# Altium project ESP32-SIM800C.PrjPCB (part 1 of 2)
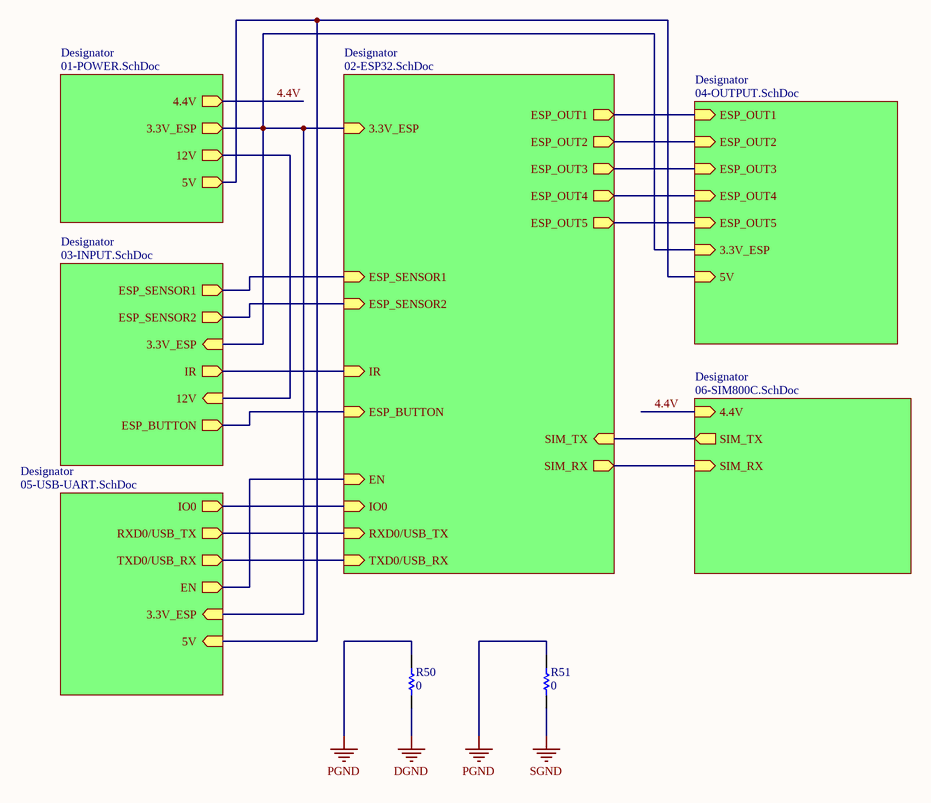
[diagram p0: Sheet1.SchDoc]
7 sheets, 149 parts. Net scope: flat (ports and power ports of the same name join across sheets).
Board file: ESP32-SIM800C_KIEN.PcbDoc
Sheets:
  Sheet1.SchDoc
    Designator = 03-INPUT.SchDoc
    Designator = 02-ESP32.SchDoc
    Designator = 01-POWER.SchDoc
    Designator = 04-OUTPUT.SchDoc
    Designator = 06-SIM800C.SchDoc
    Designator = 05-USB-UART.SchDoc

## Sheet Sheet1.SchDoc
size A; SheetNumber: 1; SheetTotal: 7

### Parts
R50  0  [RESC2012(0805)]
R51  0  [RESC2012(0805)]

### Sub-sheets
Designator = 03-INPUT.SchDoc: ESP_SENSOR1 (out), ESP_SENSOR2 (out), ESP_BUTTON (out), IR (out), 3.3V_ESP (in), 12V (in)
Designator = 02-ESP32.SchDoc: 3.3V_ESP (in), ESP_SENSOR1 (in), ESP_SENSOR2 (in), ESP_BUTTON (in), ESP_OUT1 (out), ESP_OUT2 (out), ESP_OUT3 (out), ESP_OUT4 (out), ESP_OUT5 (out), RXD0/USB_TX (in), TXD0/USB_RX (in), SIM_TX (in), SIM_RX (out), IR (in), IO0 (in), EN (in)
Designator = 01-POWER.SchDoc: 4.4V (out), 3.3V_ESP (out), 12V (out), 5V (out)
Designator = 04-OUTPUT.SchDoc: ESP_OUT1 (in), ESP_OUT2 (in), ESP_OUT3 (in), ESP_OUT4 (in), ESP_OUT5 (in), 3.3V_ESP (in), 5V (in)
Designator = 06-SIM800C.SchDoc: SIM_RX (in), SIM_TX (out), 4.4V (in)
Designator = 05-USB-UART.SchDoc: RXD0/USB_TX (out), TXD0/USB_RX (out), IO0 (out), EN (out), 3.3V_ESP (in), 5V (in)

### Nets
DGND: R50.2
PGND: R50.1 R51.1
SGND: R51.2
4.4V: sheet Designator/4.4V, sheet Designator/4.4V
(unnamed): sheet Designator/ESP_SENSOR1, sheet Designator/ESP_SENSOR1
(unnamed): sheet Designator/ESP_SENSOR2, sheet Designator/ESP_SENSOR2
(unnamed): sheet Designator/ESP_BUTTON, sheet Designator/ESP_BUTTON
(unnamed): sheet Designator/IR, sheet Designator/IR
(unnamed): sheet Designator/3.3V_ESP, sheet Designator/3.3V_ESP, sheet Designator/3.3V_ESP, sheet Designator/3.3V_ESP, sheet Designator/3.3V_ESP
(unnamed): sheet Designator/12V, sheet Designator/12V
(unnamed): sheet Designator/ESP_OUT1, sheet Designator/ESP_OUT1
(unnamed): sheet Designator/ESP_OUT2, sheet Designator/ESP_OUT2
(unnamed): sheet Designator/ESP_OUT3, sheet Designator/ESP_OUT3
(unnamed): sheet Designator/ESP_OUT4, sheet Designator/ESP_OUT4
(unnamed): sheet Designator/ESP_OUT5, sheet Designator/ESP_OUT5
(unnamed): sheet Designator/RXD0/USB_TX, sheet Designator/RXD0/USB_TX
(unnamed): sheet Designator/TXD0/USB_RX, sheet Designator/TXD0/USB_RX
(unnamed): sheet Designator/SIM_TX, sheet Designator/SIM_TX
(unnamed): sheet Designator/SIM_RX, sheet Designator/SIM_RX
(unnamed): sheet Designator/IO0, sheet Designator/IO0
(unnamed): sheet Designator/EN, sheet Designator/EN
(unnamed): sheet Designator/5V, sheet Designator/5V, sheet Designator/5V

### Library data of the parts
R50 R51 = 34.8K/R0805/1%: 0 Ohms ±1% 0.125W, 1/8W Chip Resistor 0805 (2012 Metric) Automotive AEC-Q200 Thick Film; Power Rating: 100mW; Voltage Rating: 50V; Case/Package: 0603; Case Code (Imperial): 0603; Case Code (Metric): 1608; Min Operating Temperature: -55°C; Max Operating Temperature: 155°C; Resistance: 0; Termination: SMD/SMT; Military Standard: Not; Voltage Rating (DC): 50V; Length: 1.6mm; Height: 0.45mm; Width: 0.8mm; Depth: 0.8mm; Lead Free: Lead Free; Digikey: 541-1.00KCCT-ND

## Sheet 03-INPUT.SchDoc: *INPUT
size A4; SheetNumber: 4; SheetTotal: 7
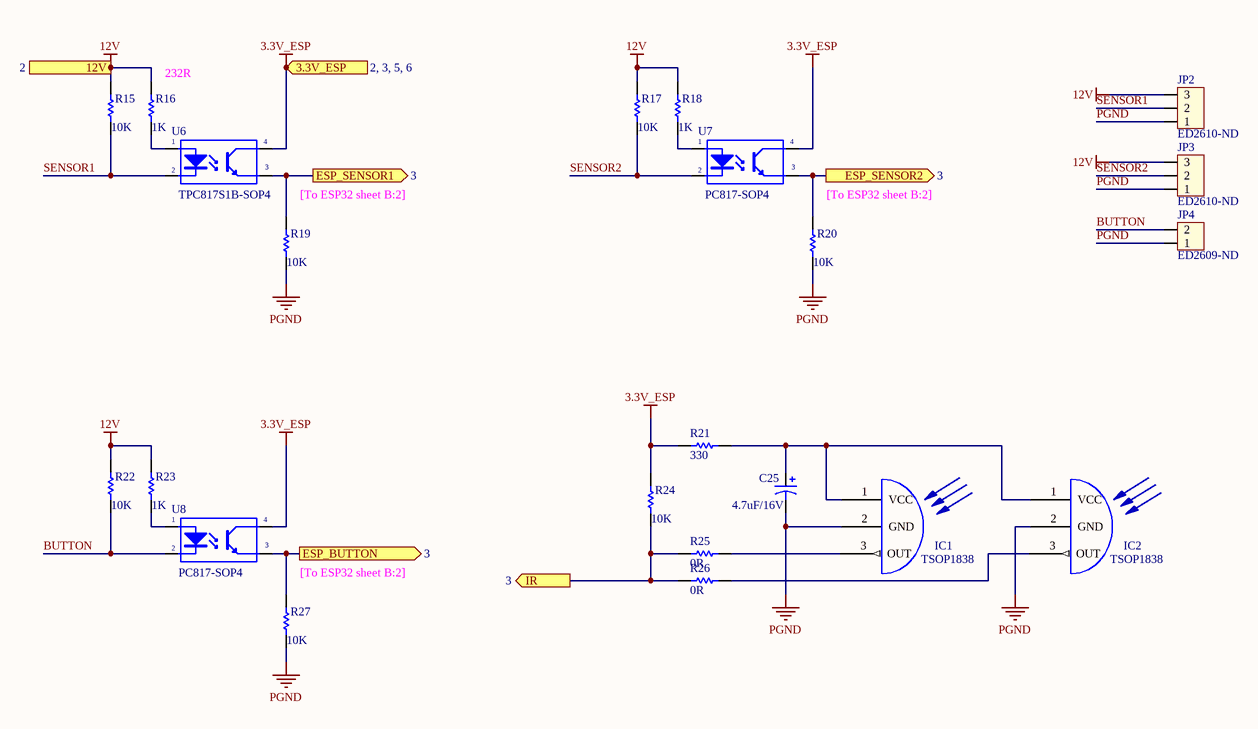
[diagram p1: 03-INPUT.SchDoc]

### Parts
C25  value 4.7uF/16V  [C0805]  (hidden comment: Cap Pol1)
IC1  TSOP1838  [TSOP1838]
IC2  TSOP1838  [TSOP1838]
JP2  ED2610-ND  [DOMINO_OSTTC_3P]
JP3  ED2610-ND  [DOMINO_OSTTC_3P]
JP4  ED2609-ND  [DOMINO_OSTTC_2P]
R15  10K  [Res 0805 SMD]
R16  1K  [Res 0805 SMD]
R17  10K  [Res 0805 SMD]
R18  1K  [Res 0805 SMD]
R19  10K  [Res 0805 SMD]
R20  10K  [Res 0805 SMD]
R21  330  [Res 0805 SMD]
R22  10K  [Res 0805 SMD]
R23  1K  [Res 0805 SMD]
R24  10K  [Res 0805 SMD]
R25  0R  [Res 0805 SMD]
R26  0R  [Res 0805 SMD]
R27  10K  [Res 0805 SMD]
U6  TPC817S1B-SOP4  [TPC817-4SOP]
U7  PC817-SOP4  [TPC817-4SOP]
U8  PC817-SOP4  [TPC817-4SOP]

### Ports
3.3V_ESP (in, see 2, 3, 5, 6), 12V (in, see 2), ESP_BUTTON (out, see 3), ESP_SENSOR1 (out, see 3), ESP_SENSOR2 (out, see 3), IR (out, see 3)

### Nets
3.3V_ESP: R21.2 R24.2 U6.4(C) U7.4(C) U8.4(C) ; port 3.3V_ESP
12V: JP2.3 JP3.3 R15.2 R16.2 R17.2 R18.2 R22.2 R23.2 ; port 12V
PGND: C25.2 IC1.2(GND) IC2.2(GND) JP2.1 JP3.1 JP4.1 R19.1 R20.1 R27.1
BUTTON: JP4.2 R22.1 U8.2(K)
SENSOR1: JP2.2 R15.1 U6.2(K)
SENSOR2: JP3.2 R17.1 U7.2(K)
NetC25_1: C25.1 IC1.1(VCC) IC2.1(VCC) R21.1
NetIC1_3: IC1.3(OUT) R25.1
NetIC2_3: IC2.3(OUT) R26.1
NetR16_1: R16.1 U6.1(A)
NetR18_1: R18.1 U7.1(A)
NetR19_2: R19.2 U6.3(E) ; port ESP_SENSOR1
NetR20_2: R20.2 U7.3(E) ; port ESP_SENSOR2
NetR23_1: R23.1 U8.1(A)
NetR24_1: R24.1 R25.2 R26.2 ; port IR
NetR27_2: R27.2 U8.3(E) ; port ESP_BUTTON

### Notes on the sheet
- (near R16) 232R
- [To ESP32 sheet B:2]
- Title
- Size:
- Date:
- A4
- Number:
- Time:
- Revision:
- Sheet
- of
- File:

### Library data of the parts
C25 = Cap Pol1: Polarized Capacitor (Radial); Published: 8-Jun-2000; LatestRevisionDate: 17-Jul-2002; LatestRevisionNote: Re-released for DXP Platform.; PackageReference: RB7.6-15; Publisher: Altium Limited; PackageDescription: Polarized Capacitor (Radial); 2 Leads
JP2 JP3 = Con3: 3 Position Wire to Board Terminal Block Horizontal with Board 0.200" (5.08mm) Through Hole; Value: Connector 3; Digikey: ED2610-ND
JP4 = Con2: 2 Position Wire to Board Terminal Block Horizontal with Board 0.200" (5.08mm) Through Hole; Value: Connector 2; Digikey: ED2609-ND
R15 R17 R22 = 10K/R0603/1%: RES SMD 10K OHM 1% 1/10W 0603; Manufacturer: Yageo; Manufacturer Part Number: RC0603FR-0710KL; Power (Watts): 0.1W, 1/10W; Temperature Coefficient: ±100ppm/°C; Supplier 1: Digi-Key; RoHS: RoHS Compliant; Category: Resistors; Stock 1: 11440000; Pricing 1: 5000=0.00167, 10000=0.00145, 25000=0.00128, 50000=0.00117, 125000=0.00115 (USD); Packaging: Tape & Reel (TR); Resistance (Ohms): 10k; Tolerance: ±1%; Composition: Thick Film; Features: Moisture Resistant; Operating Temperature: -55°C ~ 155°C; Package / Case: 0603 (1608 Metric); Supplier Device Package: 0603; Size / Dimension: 0.063" L x 0.031" W (1.60mm x 0.80mm); Height: 0.022" (0.55mm); Number of Terminations: 2; ComponentLink1URL: http://www.yageo.com/NewPortal/yageodocoutput?fileName=/pdf/R-Chip/PYu-RC_Group_51_RoHS_L_3.pdf; ComponentLink1Description: http://www.yageo.com/NewPortal/yageodocoutput?fileName=/pdf/R-Chip/PYu-RC_Group_51_RoHS_L_3.pdf; Supplier Part Number 1: 311-10.0KHRTR-ND
R16 R18 R23 = 10K/R0603/1%: 1 kOhms ±1% 0.125W, 1/8W Chip Resistor 0805 (2012 Metric) Automotive AEC-Q200 Thick Film; Resistance (Ohms): 10k; Power (Watts): 0.1W, 1/10W; RoHS: RoHS Compliant; Category: Resistors; Features: Moisture Resistant; Operating Temperature: -55°C ~ 155°C; Package / Case: 0603 (1608 Metric); Supplier Device Package: 0603; Size / Dimension: 0.063" L x 0.031" W (1.60mm x 0.80mm); Height: 0.022" (0.55mm); Number of Terminations: 2; ComponentLink1URL: http://www.yageo.com/NewPortal/yageodocoutput?fileName=/pdf/R-Chip/PYu-RC_Group_51_RoHS_L_3.pdf; ComponentLink1Description: http://www.yageo.com/NewPortal/yageodocoutput?fileName=/pdf/R-Chip/PYu-RC_Group_51_RoHS_L_3.pdf; Digikey: 541-1.00KCCT-ND
R19-R21 R24-R27 = 249K/R0805/1%: RES SMD 249K OHM 1% 1/10W 0805; Manufacturer: Yageo; Manufacturer Part Number: RC0603FR-07249KL; Power (Watts): 0.1W, 1/10W; Temperature Coefficient: ±100ppm/°C; Supplier 1: Digi-Key; RoHS: RoHS Compliant; Category: Resistors; Stock 1: 370515; Pricing 1: 1=0.1, 10=0.015, 100=0.006, 1000=0.00268, 2500=0.00233 (USD); Packaging: Cut Tape (CT); Part Status: Active; Tolerance: ±1%; Composition: Thick Film; Features: Moisture Resistant; Operating Temperature: -55°C ~ 155°C; Package / Case: 0603 (1608 Metric); Supplier Device Package: 0603; Size / Dimension: 0.063" L x 0.032" W (1.60mm x 0.80mm); Height - Seated (Max): 0.022" (0.55mm); Failure Rate: -; ComponentLink1URL: http://www.yageo.com/documents/recent/PYu-RC_Group_51_RoHS_L_8.pdf; ComponentLink1Description: http://www.yageo.com/documents/recent/PYu-RC_Group_51_RoHS_L_8.pdf
U6-U8 = PC817: Optoisolator Transistor Output 5000Vrms 1 Channel 4-SOP; Digikey: TPC817S1BRAGCT-ND
  U7 U8: BuyVN: https://banlinhkien.vn/goods-1134-pc817-el817-sop4-opto.html

## Sheet 02-ESP32.SchDoc: *ESP32LX6
size A4; SheetNumber: 3; SheetTotal: 7
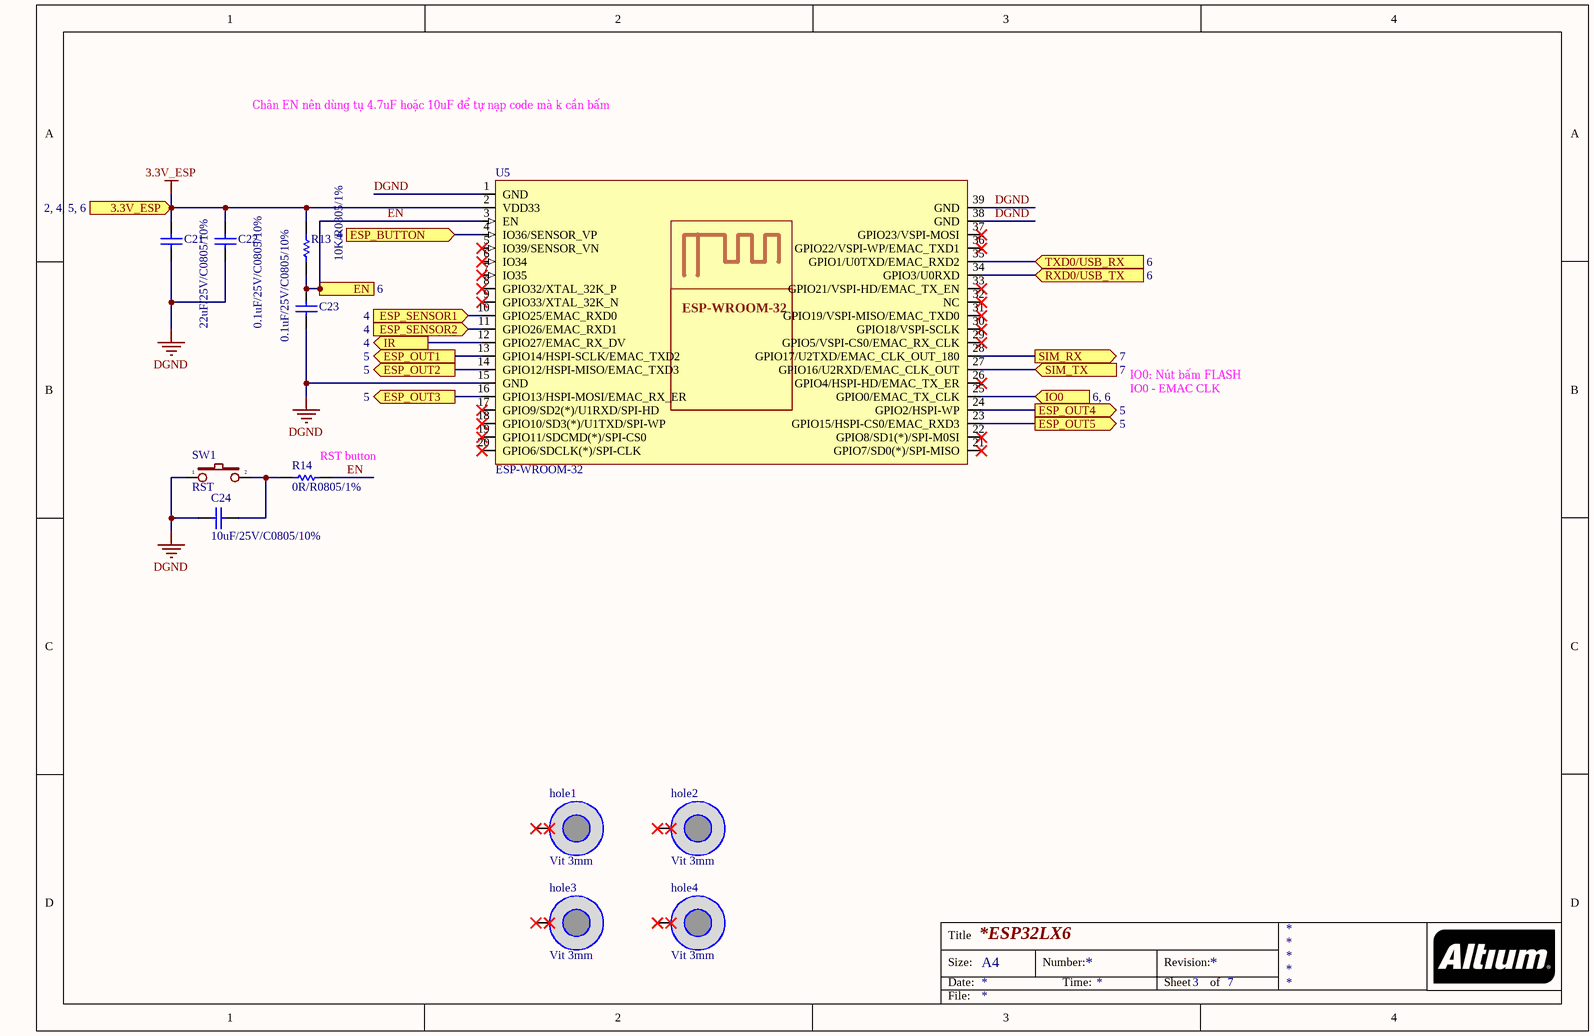
[diagram p2: 02-ESP32.SchDoc]

### Parts
C21  22uF/25V/C0805/10%  [CAP_CERA_C2012(CC0805INCH)]
C22  0.1uF/25V/C0805/10%  [CAP_CERA_C2012(CC0805INCH)]
C23  0.1uF/25V/C0805/10%  [CAP_CERA_C2012(CC0805INCH)]
C24  10uF/25V/C0805/10%  [CAP_CERA_C2012(CC0805INCH)]
hole1  Vit 3mm  [Screw 3.0]
hole2  Vit 3mm  [Screw 3.0]
hole3  Vit 3mm  [Screw 3.0]
hole4  Vit 3mm  [Screw 3.0]
R13  10K/R0805/1%  [Res 0805 SMD]
R14  0R/R0805/1%  [Res 0805 SMD]
SW1  RST  [Button 3x4mm]
U5  ESP-WROOM-32  [ESP32 WROOM]

### Ports
3.3V_ESP (in, see 2, 4, 5, 6), EN (in, see 6), ESP_BUTTON (in, see 4), ESP_OUT1 (out, see 5), ESP_OUT2 (out, see 5), ESP_OUT3 (out, see 5), ESP_OUT4 (out, see 5), ESP_OUT5 (out, see 5), ESP_SENSOR1 (in, see 4), ESP_SENSOR2 (in, see 4), IO0 (in, see 6, 6), IR (out, see 4), RXD0/USB_TX (in, see 6), SIM_RX (out, see 7), SIM_TX (in, see 7), TXD0/USB_RX (in, see 6)

### Nets
3.3V_ESP: C21.2 C22.2 R13.1 U5.2(VDD33) ; port 3.3V_ESP
DGND: C21.1 C22.1 C23.1 C24.2 SW1.1 U5.1(GND) U5.15(GND) U5.38(GND) U5.39(GND)
EN: C23.2 R13.2 R14.2 U5.3(EN) ; port EN
IO0: U5.25(GPIO0/EMAC_TX_CLK) ; port IO0
SIM_RX: U5.28(GPIO17/U2TXD/EMAC_CLK_OUT_180) ; port SIM_RX
SIM_TX: U5.27(GPIO16/U2RXD/EMAC_CLK_OUT) ; port SIM_TX
NetC24_1: C24.1 R14.1 SW1.2
NetR19_2: U5.10(GPIO25/EMAC_RXD0) ; port ESP_SENSOR1
NetR20_2: U5.11(GPIO26/EMAC_RXD1) ; port ESP_SENSOR2
NetR24_1: U5.12(GPIO27/EMAC_RX_DV) ; port IR
NetR27_2: U5.4(IO36/SENSOR_VP) ; port ESP_BUTTON
NetR35_1: U5.34(GPIO3/U0RXD) ; port RXD0/USB_TX
NetR36_1: U5.35(GPIO1/U0TXD/EMAC_RXD2) ; port TXD0/USB_RX
NetU5_13: U5.13(GPIO14/HSPI-SCLK/EMAC_TXD2) ; port ESP_OUT1
NetU5_14: U5.14(GPIO12/HSPI-MISO/EMAC_TXD3) ; port ESP_OUT2
NetU5_16: U5.16(GPIO13/HSPI-MOSI/EMAC_RX_ER) ; port ESP_OUT3
NetU5_23: U5.23(GPIO15/HSPI-CS0/EMAC_RXD3) ; port ESP_OUT5
NetU5_24: U5.24(GPIO2/HSPI-WP) ; port ESP_OUT4

Not connected (* = marked no-connect by the designer): hole1 1(hole)*; hole2 1(hole)*; hole3 1(hole)*; hole4 1(hole)*; U5 5(IO39/SENSOR_VN)* 6(IO34)* 7(IO35)* 8(GPIO32/XTAL_32K_P)* 9(GPIO33/XTAL_32K_N)* 17(GPIO9/SD2(*)/U1RXD/SPI-HD)* 18(GPIO10/SD3(*)/U1TXD/SPI-WP)* 19(GPIO11/SDCMD(*)/SPI-CS0)* 20(GPIO6/SDCLK(*)/SPI-CLK)* 21(GPIO7/SD0(*)/SPI-MISO)* 22(GPIO8/SD1(*)/SPI-M0SI)* 26(GPIO4/HSPI-HD/EMAC_TX_ER)* 29(GPIO5/VSPI-CS0/EMAC_RX_CLK)* 30(GPIO18/VSPI-SCLK)* 31(GPIO19/VSPI-MISO/EMAC_TXD0)* 32(NC)* 33(GPIO21/VSPI-HD/EMAC_TX_EN)* 36(GPIO22/VSPI-WP/EMAC_TXD1)* 37(GPIO23/VSPI-MOSI)*

### Notes on the sheet
- Chân EN nên dùng tụ 4.7uF hoặc 10uF để tự nạp code mà k cần bấm
- IO0: Nút bấm FLASH
- IO0 - EMAC CLK
- (near R14) RST button
- Title
- Size:
- Date:
- A4
- Number:
- Time:
- Revision:
- Sheet
- of
- File:

### Library data of the parts
C21 = 0.1uF/50V/C0603/10%: 22µF ±20% 25V Ceramic Capacitor X5R 0805 (2012 Metric); Manufacturer: Tariff Applied; ComponentLink1URL: http://www.murata.com/~/media/webrenewal/support/library/catalog/products/capacitor/mlcc/c02e.ashx; ComponentLink1Description: http://www.murata.com/~/media/webrenewal/support/library/catalog/products/capacitor/mlcc/c02e.ashx; Digikey: 1276-2908-1-ND
C22-C24 = 0.1uF/50V/C0603/10%: 0.1µF ±10% 25V Ceramic Capacitor X7R 0805 (2012 Metric); ComponentLink1URL: http://www.murata.com/~/media/webrenewal/support/library/catalog/products/capacitor/mlcc/c02e.ashx; ComponentLink1Description: http://www.murata.com/~/media/webrenewal/support/library/catalog/products/capacitor/mlcc/c02e.ashx; Digikey: 478-3755-1-ND
R13 = 200K/R0603/1%: 10 kOhms ±1% 0.125W, 1/8W Chip Resistor 0805 (2012 Metric) Thick Film; Power (Watts): 0.1W, 1/10W; RoHS: RoHS Compliant; Category: Resistors; Part Status: Active; Features: Moisture Resistant; Operating Temperature: -55°C ~ 155°C; Package / Case: 0603 (1608 Metric); Supplier Device Package: 0603; Size / Dimension: 0.063" L x 0.031" W (1.60mm x 0.80mm); Height - Seated (Max): 0.022" (0.55mm); Failure Rate: -; ComponentLink1URL: http://www.yageo.com/documents/recent/PYu-RC_Group_51_RoHS_L_7.pdf; ComponentLink1Description: http://www.yageo.com/documents/recent/PYu-RC_Group_51_RoHS_L_7.pdf; Digikey: A126332CT-ND
R14 = 200K/R0603/1%: 0 Ohms Jumper 0.125W, 1/8W Chip Resistor 0805 (2012 Metric) Automotive AEC-Q200 Thick Film; Part Status: Active; Height - Seated (Max): 0.022" (0.55mm); Failure Rate: -; ComponentLink1URL: http://www.yageo.com/documents/recent/PYu-RC_Group_51_RoHS_L_7.pdf; ComponentLink1Description: http://www.yageo.com/documents/recent/PYu-RC_Group_51_RoHS_L_7.pdf; Digikey: 541-0.0ACT-ND
SW1 = SW2: SWITCH TACTILE SPST-NO 0.05A 12V; Digikey: CKN10384CT-ND
U5 = ESP-WROOM-32: ESP-WROOM-32 (8MB), WIFI MODULE 64 MBITS SPI FLASH; Digikey: 1904-1019-1-ND

## Sheet 01-POWER.SchDoc: *NGUON4V4
size A3; SheetNumber: 2; SheetTotal: 7
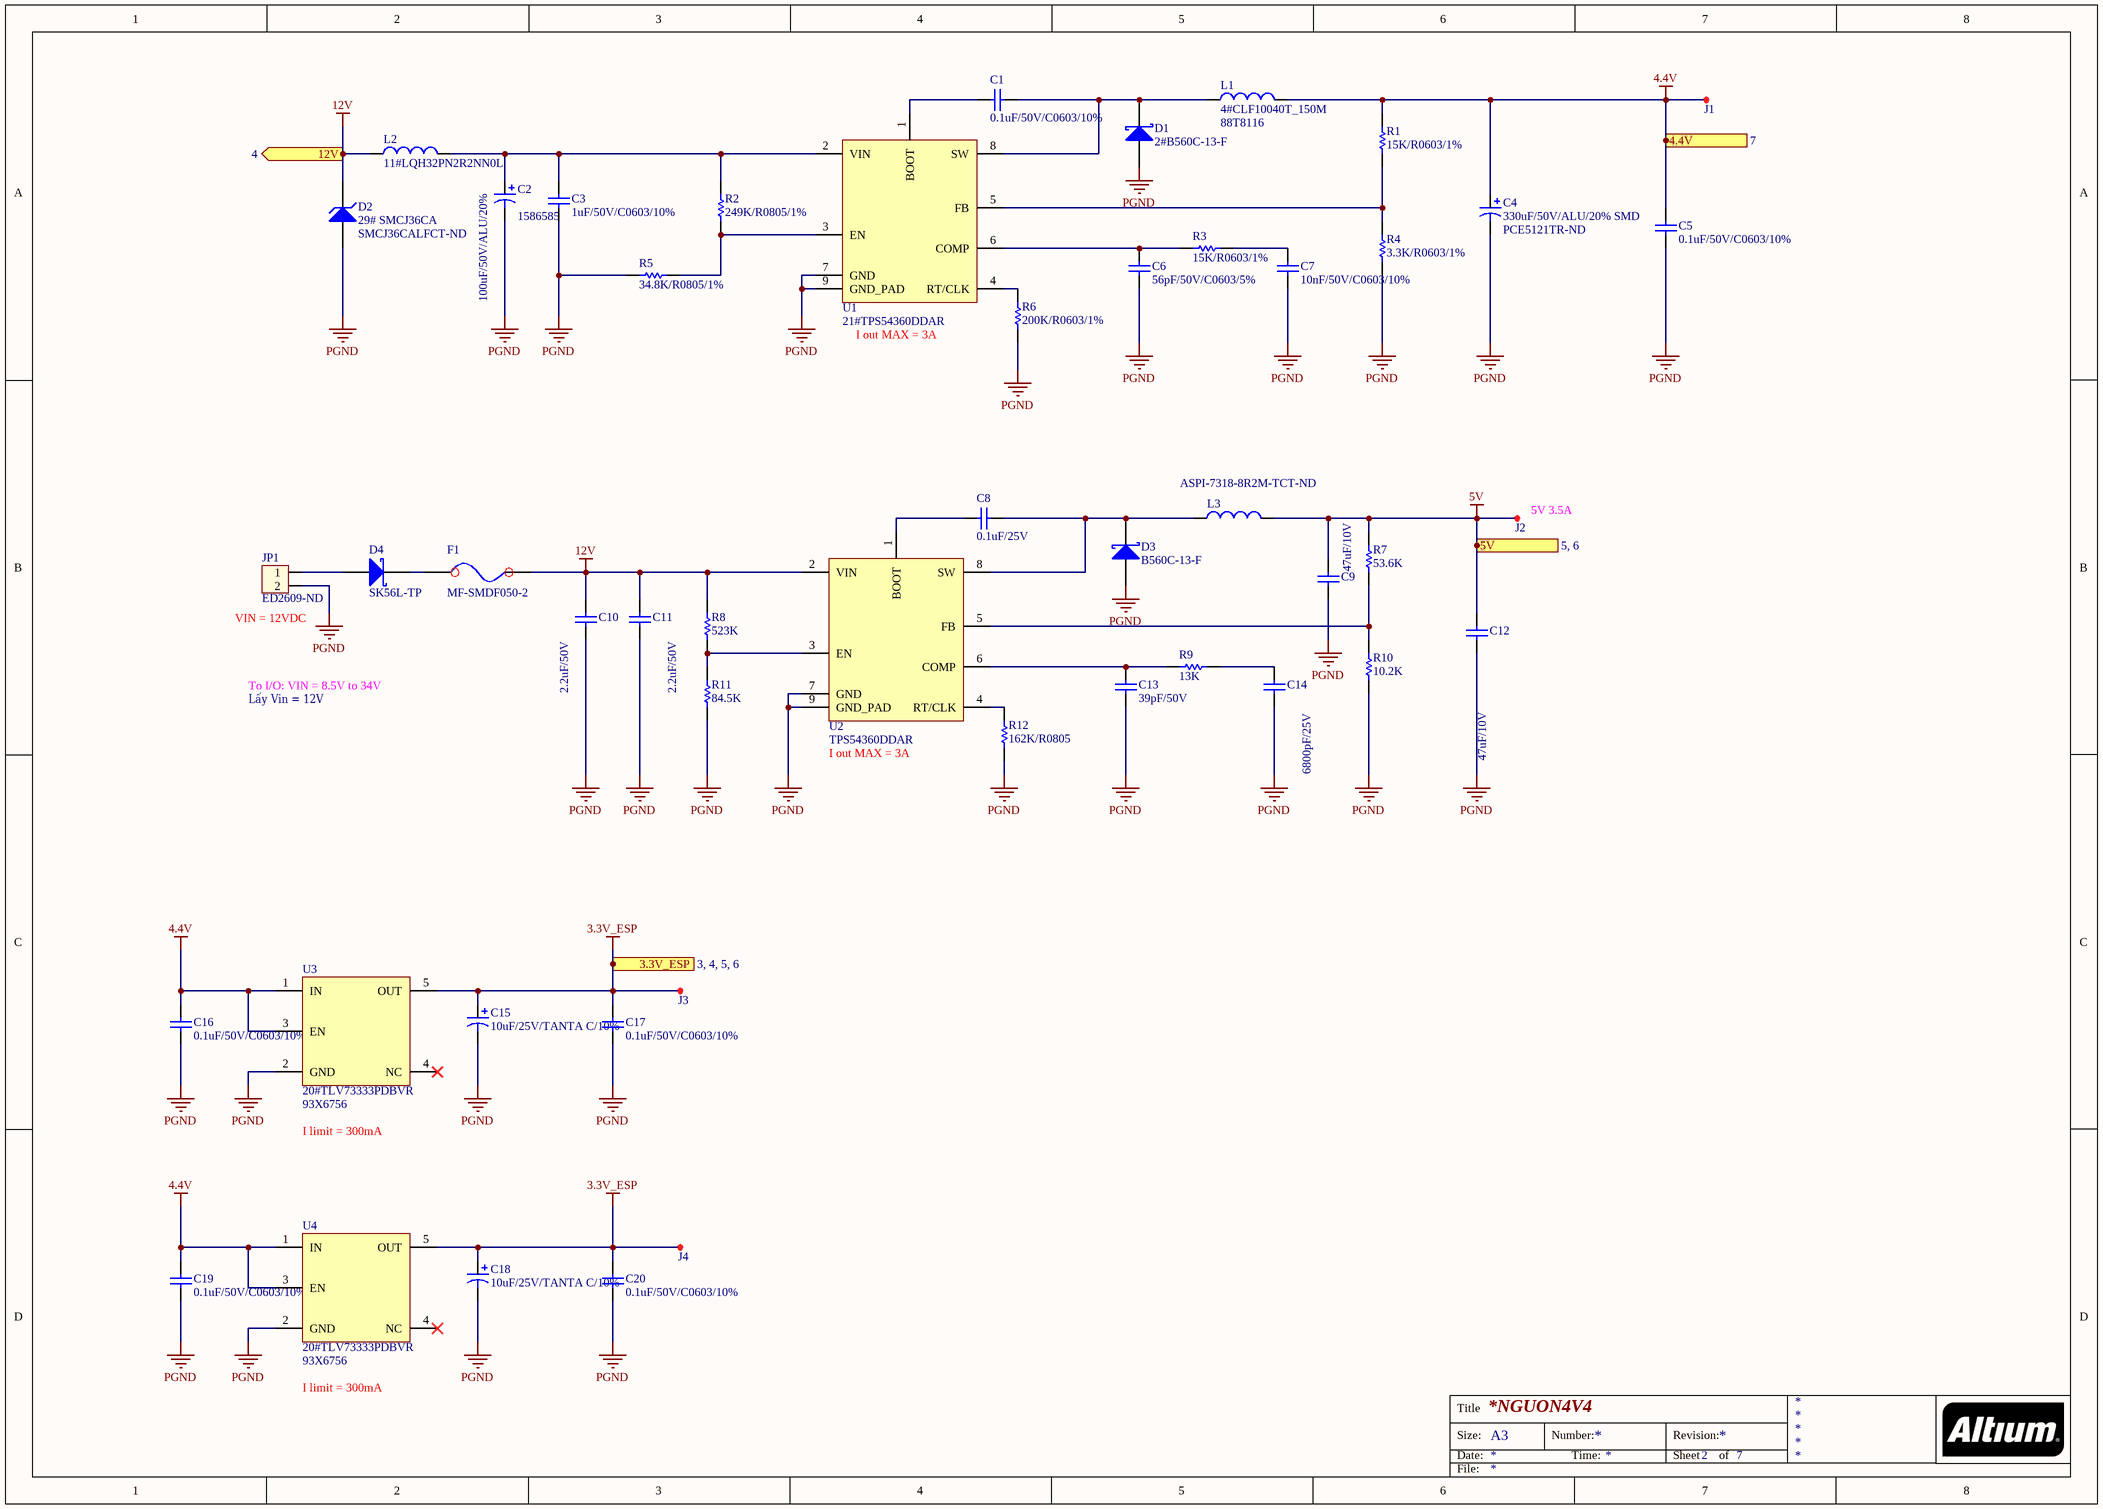
[diagram p3: 01-POWER.SchDoc]

### Parts
C1  0.1uF/50V/C0603/10%  [Cap Ceramic 0603 SMD]
C2  100uF/50V/ALU/20%  Supplier Part Number 1: 1586585  [CAP ALU CASE F SMD]
C3  1uF/50V/C0603/10%  [Cap Ceramic 0603 SMD]
C4  330uF/50V/ALU/20% SMD  Supplier Part Number 1: PCE5121TR-ND  [CAP ALU CASE G SMD]
C5  0.1uF/50V/C0603/10%  [Cap Ceramic 0603 SMD]
C6  56pF/50V/C0603/5%  [Cap Ceramic 0603 SMD]
C7  10nF/50V/C0603/10%  [Cap Ceramic 0603 SMD]
C8  0.1uF/25V  [CAP_CERA_C2012(CC0805INCH)]
C9  47uF/10V  [CAP_CERA_C2012(CC0805INCH)]
C10  2.2uF/50V  [CAP_CERA_C2012(CC0805INCH)]
C11  2.2uF/50V  [CAP_CERA_C2012(CC0805INCH)]
C12  47uF/10V  [CAP_CERA_C2012(CC0805INCH)]
C13  39pF/50V  [CAP_CERA_C2012(CC0805INCH)]
C14  6800pF/25V  [CAP_CERA_C2012(CC0805INCH)]
C15  10uF/25V/TANTA C/10%  [CAP TANT CASE C SMD]
C16  0.1uF/50V/C0603/10%  [Cap Ceramic 0603 SMD]
C17  0.1uF/50V/C0603/10%  [Cap Ceramic 0603 SMD]
C18  10uF/25V/TANTA C/10%  [CAP TANT CASE C SMD]
C19  0.1uF/50V/C0603/10%  [Cap Ceramic 0603 SMD]
C20  0.1uF/50V/C0603/10%  [Cap Ceramic 0603 SMD]
D1  2#B560C-13-F  [2# B560C]
D2  29# SMCJ36CA  Supplier Part Number 1: SMCJ36CALFCT-ND  [29# diode SMCJ36A]
D3  B560C-13-F  [2# B560C]
D4  SK56L-TP  [30# SK56L-TPMSCT-ND]
F1  MF-SMDF050-2  [13# MF-SMDF050]
J1  TEST POINT  [TEST POINT 1mm]  (value not drawn)
J2  TEST POINT  [TEST POINT 1mm]  (value not drawn)
J3  TEST POINT  [TEST POINT 1mm]  (value not drawn)
J4  TEST POINT  [TEST POINT 1mm]  (value not drawn)
JP1  ED2609-ND  [DOMINO_OSTTC_2P]
L1  4#CLF10040T_150M  Supplier Part Number 1: 88T8116  [4# clf10040XX]
L2  11#LQH32PN2R2NN0L  [11# LQH32PN2R2]
L3  ASPI-7318-8R2M-TCT-ND  [ASPI-7318-8R2M-TCT-ND]
R1  15K/R0603/1%  [Res 0603 SMD]
R2  249K/R0805/1%  [Res 0805 SMD]
R3  15K/R0603/1%  [Res 0603 SMD]
R4  3.3K/R0603/1%  [Cap Ceramic 0603 SMD]
R5  34.8K/R0805/1%  [Res 0805 SMD]
R6  200K/R0603/1%  [Res 0603 SMD]
R7  53.6K  [Res 0805 SMD]
R8  523K  [Res 0805 SMD]
R9  13K  [Res 0805 SMD]
R10  10.2K  [Res 0805 SMD]
R11  84.5K  [Res 0805 SMD]
R12  162K/R0805  [Res 0805 SMD]
U1  21#TPS54360DDAR  [21# TPS54360]
U2  TPS54360DDAR  [21# TPS54360]
U3  20#TLV73333PDBVR  Supplier Part Number 1: 93X6756  [TLV73333PDBVR - SOT23-65]
U4  20#TLV73333PDBVR  Supplier Part Number 1: 93X6756  [TLV73333PDBVR - SOT23-65]

### Ports
3.3V_ESP (out, see 3, 4, 5, 6), 4.4V (out, see 7), 5V (out, see 5, 6), 12V (out, see 4)

### Nets
3.3V_ESP: C15.1 C17.2 C18.1 C20.2 J3.1(TP) J4.1(TP) U3.5(OUT) U4.5(OUT) ; port 3.3V_ESP
4.4V: C4.1 C5.2 C16.2 C19.2 J1.1(TP) L1.2 R1.2 U3.1(IN) U3.3(EN) U4.1(IN) U4.3(EN) ; port 4.4V
5V: C9.2 C12.2 J2.1(TP) L3.2 R7.2 ; port 5V
12V: C10.2 C11.2 D2.2(K) F1.2(OUT) L2.1 R8.2 U2.2(VIN) ; port 12V
PGND: C2.2 C3.1 C4.2 C5.1 C6.1 C7.1 C9.1 C10.1 C11.1 C12.1 C13.1 C14.1 C15.2 C16.1 C17.1 C18.2 C19.1 C20.1 D1.1(A) D2.1(A) D3.1(A) JP1.2 R4.1 R5.1 R6.2 R10.1 R11.1 R12.2 U1.7(GND) U1.9(GND_PAD) U2.7(GND) U2.9(GND_PAD) U3.2(GND) U4.2(GND)
NetC1_1: C1.1 U1.1(BOOT)
NetC1_2: C1.2 D1.2(K) L1.1 U1.8(SW)
NetC2_1: C2.1 C3.2 L2.2 R2.2 U1.2(VIN)
NetC6_2: C6.2 R3.2 U1.6(COMP)
NetC7_2: C7.2 R3.1
NetC8_1: C8.1 D3.2(K) L3.1 U2.8(SW)
NetC8_2: C8.2 U2.1(BOOT)
NetC13_2: C13.2 R9.2 U2.6(COMP)
NetC14_2: C14.2 R9.1
NetD4_1: D4.1(A) JP1.1
NetD4_2: D4.2(K) F1.1(IN)
NetR1_1: R1.1 R4.2 U1.5(FB)
NetR2_1: R2.1 R5.2 U1.3(EN)
NetR6_1: R6.1 U1.4(RT/CLK)
NetR7_1: R7.1 R10.2 U2.5(FB)
NetR8_1: R8.1 R11.2 U2.3(EN)
NetR12_1: R12.1 U2.4(RT/CLK)

Not connected (* = marked no-connect by the designer): U3 4(NC)*; U4 4(NC)*

### Notes on the sheet
- (near U1) I out MAX = 3A
- (near J2) 5V 3.5A
- (near JP1) VIN = 12VDC
- To I/O: VIN = 8.5V to 34V
- Lấy Vin = 12V
- (near U2) I out MAX = 3A
- I limit = 300mA
- Title
- Size:
- Date:
- A3
- Number:
- Time:
- Revision:
- Sheet
- of
- File:

### Library data of the parts
C1 C5 C16 C17 C19 C20 = 0.1uF/50V/C0603/10%: CAP CER 0.1UF 50V 10% X7R 0603; Manufacturer: Murata Electronics North America; Manufacturer Part Number: GRM188R71H104KA93D; Capacitance: 0.1µF; RoHS: RoHS Compliant; Category: Capacitors; Packaging: Tape & Reel (TR); Tolerance: ±10%; Voltage - Rated: 50V; Temperature Coefficient: X7R; Mounting Type: Surface Mount, MLCC; Operating Temperature: -55°C ~ 125°C; Applications: General Purpose; Ratings: -; Package / Case: 0603 (1608 Metric); Size / Dimension: 0.063" L x 0.031" W (1.60mm x 0.80mm); Height - Seated (Max): -; Thickness (Max): 0.035" (0.90mm); Lead Spacing: -; Features: -; Lead Style: -; ComponentLink1URL: http://www.murata.com/~/media/webrenewal/support/library/catalog/products/capacitor/mlcc/c02e.ashx; ComponentLink1Description: http://www.murata.com/~/media/webrenewal/support/library/catalog/products/capacitor/mlcc/c02e.ashx; Supplier 1: Digi-Key; Supplier Part Number 1: 490-1519-1-ND
C2 = 100uF/50V/ALU 8X11.5/20%: CAP ALU 100UF 20% 50V RADIAL; Manufacturer: Panasonic Electronic Components; Manufacturer Part Number: ECA-1HM101B; Capacitance: 100µF; Lifetime @ Temp.: 2000 Hrs @ 85°C; Ripple Current: 250mA; RoHS: RoHS Compliant; Category: Capacitors; Packaging: Tape & Box (TB); Tolerance: ±20%; Voltage Rating: 50V; ESR (Equivalent Series Resistance): -; Operating Temperature: -40°C ~ 85°C; Type: -; Applications: General Purpose; Impedance: -; Lead Spacing: 0.197" (5.00mm); Size / Dimension: 0.315" Dia (8.00mm); Height - Seated (Max): 0.492" (12.50mm); Surface Mount Land Size: -; Mounting Type: Through Hole; Package / Case: Radial, Can; ComponentLink1URL: http://industrial.panasonic.com/www-cgi/jvcr13pz.cgi?E+PZ+3+ABA0012+ECA1HM101B+7+WW; ComponentLink1Description: http://industrial.panasonic.com/www-cgi/jvcr13pz.cgi?E+PZ+3+ABA0012+ECA1HM101B+7+WW; Supplier 1: Future Electronics
C3 = 1uF/50V/C0603/10%: CAP CER 1UF 50V X7R 0603; Manufacturer: Samsung Electro-Mechanics America, Inc.; Manufacturer Part Number: CL21B105KBFNNNE; Capacitance: 1µF; Tolerance: ±10%; RoHS: RoHS Compliant; Category: Capacitors; Packaging: Cut Tape (CT); Voltage - Rated: 50V; Temperature Coefficient: X7R; Mounting Type: Surface Mount, MLCC; Operating Temperature: -55°C ~ 125°C; Applications: General Purpose; Ratings: -; Package / Case: 0805 (2012 Metric); Size / Dimension: 0.079" L x 0.049" W (2.00mm x 1.25mm); Height - Seated (Max): -; Thickness (Max): 0.053" (1.35mm); Lead Spacing: -; Features: -; Lead Style: -; ComponentLink1URL: http://www.samsungsem.com/kr/support/product-search/mlcc/CL21B105KBFNNNE.jsp; ComponentLink1Description: http://www.samsungsem.com/kr/support/product-search/mlcc/CL21B105KBFNNNE.jsp; Supplier 1: Digi-Key; Supplier Part Number 1: 1276-1029-1-ND
C4 = 330uF/50V/ALU12.5X20mm/20%/7000Hrs: CAP ALU 330UF 20% 50V SMD; Manufacturer: Nichicon; Manufacturer Part Number: UPW1J331MHD; Lifetime @ Temp.: 7000 Hrs @ 105°C; Polarization: Polar; Ripple Current - Low Frequency: 838.5mA @ 120Hz; Ripple Current - High Frequency: 1.29A @ 100kHz; RoHS: RoHS Compliant; Category: Capacitors; Packaging: Bulk; Part Status: Active; Tolerance: ±20%; ESR (Equivalent Series Resistance): -; Operating Temperature: -55°C ~ 105°C; Applications: General Purpose; Lead Spacing: 0.197" (5.00mm); Size / Dimension: 0.492" Dia (12.50mm); Height - Seated (Max): 0.787" (20.00mm); Surface Mount Land Size: -; Mounting Type: Through Hole; Package / Case: Radial, Can; ComponentLink1URL: http://nichicon-us.com/english/products/pdfs/e-upw.pdf; ComponentLink1Description: http://nichicon-us.com/english/products/pdfs/e-upw.pdf; Supplier 1: Digi-Key
C6 = 56pF/50V/C0603/5%: Cap Ceramic 56pF 50V C0G 5% SMD 0603 125C Paper T/R; Manufacturer: Samsung; Manufacturer Part Number: CL10C560JB8NNNC; Temperature Coefficient: 30ppm/°C; Supplier 1: Digi-Key; Stock 1: 40000; Pricing 1: 1=0.1, 10=0.056, 100=0.0251, 500=0.0179, 1000=0.0141 (USD); Mount: Surface Mount; Case/Package: 0603; Case Code (Metric): 1608; Case Code (Imperial): 0603; Material: Ceramic; Min Operating Temperature: -55°C; Max Operating Temperature: 125°C; Capacitance: 56pF; Tolerance: 5%; Packaging: Tape and Reel; Voltage Rating: 50V; Package Quantity: 1; Dielectric: C0G; Voltage: 50V; Termination: SMD/SMT; Voltage Rating (DC): 50V; Length: 1.6mm; Height: 0.8mm; Width: 0.031inch; Thickness: 0.035inch; Depth: 0.8mm; Radiation Hardening: No; Lead Free: Lead Free; Supplier Part Number 1: 1276-1197-1-ND
C7 = 10nF/50V/C0603/10%: CAP CER 10000PF 50V X7R 0603; Manufacturer: Murata Electronics North America; Manufacturer Part Number: GRM188R71H103KA01D; Tolerance: ±10%; RoHS: RoHS Compliant; Category: Capacitors; Packaging: Cut Tape (CT); Capacitance: 10000pF; Voltage - Rated: 50V; Temperature Coefficient: X7R; Mounting Type: Surface Mount, MLCC; Operating Temperature: -55°C ~ 125°C; Applications: General Purpose; Ratings: -; Package / Case: 0603 (1608 Metric); Size / Dimension: 0.063" L x 0.031" W (1.60mm x 0.80mm); Height - Seated (Max): -; Thickness (Max): 0.035" (0.90mm); Lead Spacing: -; Features: -; Lead Style: -; ComponentLink1URL: http://www.murata.com/~/media/webrenewal/support/library/catalog/products/capacitor/mlcc/c02e.ashx; ComponentLink1Description: http://www.murata.com/~/media/webrenewal/support/library/catalog/products/capacitor/mlcc/c02e.ashx; Supplier 1: Digi-Key; Supplier Part Number 1: 490-1512-1-ND
C8 = 0.1uF/50V/C0603/10%: 0.1µF ±10% 25V Ceramic Capacitor X7R 0805 (2012 Metric); Manufacturer: AVX Corporation; ComponentLink1URL: http://www.murata.com/~/media/webrenewal/support/library/catalog/products/capacitor/mlcc/c02e.ashx; ComponentLink1Description: http://www.murata.com/~/media/webrenewal/support/library/catalog/products/capacitor/mlcc/c02e.ashx; Digikey: 478-3755-1-ND
C9 C12 = 0.1uF/50V/C0603/10%: 47µF ±20% 10V Ceramic Capacitor X5R 0805 (2012 Metric); Manufacturer: Murata; ComponentLink1URL: http://www.murata.com/~/media/webrenewal/support/library/catalog/products/capacitor/mlcc/c02e.ashx; ComponentLink1Description: http://www.murata.com/~/media/webrenewal/support/library/catalog/products/capacitor/mlcc/c02e.ashx; Digikey: 490-9961-1-ND
C10 C11 = 1uF/50V/C0603/10%: 2.2µF ±10% 50V Ceramic Capacitor JB 0805 (2012 Metric); Manufacturer: TDK; ComponentLink1URL: http://www.samsungsem.com/kr/support/product-search/mlcc/CL21B105KBFNNNE.jsp; ComponentLink1Description: http://www.samsungsem.com/kr/support/product-search/mlcc/CL21B105KBFNNNE.jsp; Digikey: 445-11501-1-ND
C13 = 56pF/50V/C0603/5%: 39pF ±10% 50V Ceramic Capacitor C0G, NP0 0805 (2012 Metric); Manufacturer: KEMET; Digikey: 399-9232-1-ND
C14 = 10nF/50V/C0603/10%: 6800pF ±10% 25V Ceramic Capacitor X7R 0805 (2012 Metric); Manufacturer: Wurth Electronics Inc.; ComponentLink1URL: http://www.murata.com/~/media/webrenewal/support/library/catalog/products/capacitor/mlcc/c02e.ashx; ComponentLink1Description: http://www.murata.com/~/media/webrenewal/support/library/catalog/products/capacitor/mlcc/c02e.ashx; Digikey: 732-8054-1-ND
C15 C18 = TAJB106M025RNJ: Tantalum Capacitors - Solid SMD 25v 10uF 20%Tol Code C; Manufacturer: Kyocera AVX; Tolerance: 20%; ESR (Equivalent Series Resistance): 2.5R; Leakage Current: 2.5uA; Polarity: Polar; Dissipation Factor: 6%; Supplier 1: Digi-Key; Manufacturer Part Number: TAJB106M025RNJ; Stock 1: 10615; Pricing 1: 1=0.74, 10=0.524, 100=0.3453, 500=0.2558, 1000=0.2174 (USD); Mount: Surface Mount; Case/Package: 1210; Weight: 0.000564oz; Case Code (Metric): 3528; Case Code (Imperial): 1210; Min Operating Temperature: -55°C; Max Operating Temperature: 125°C; Packaging: Tape and Reel; Capacitance: 10uF; Voltage Rating: 25V; Package Quantity: 2000; Termination: SMD/SMT; Voltage Rating (DC): 25V; Features: General Purpose; Length: 3.5mm; Height: 2.1mm; Width: 0.11inch; Height - Seated (Max): 0.083inch; Depth: 2.8mm; Lead Free: Lead Free; Supplier Part Number 1: 478-8887-1-ND
D1 = 2#B560C-13-F: DIODE SCHOTTKY 60V 5A SMC; Manufacturer: Diodes; Peak Reverse Current: 500uA; Forward Voltage: 700mV; Max Forward Surge Current (Ifsm): 100A; Element Configuration: Single; Polarity: Standard; Capacitance: 300pF; Supplier 1: Digi-Key; Manufacturer Part Number: B560C-13-F; Stock 1: 183351; Pricing 1: 1=0.55, 10=0.467, 100=0.349, 500=0.2742, 1000=0.2119 (USD); Mount: Surface Mount; Case/Package: SMC; Number of Pins: 2; Weight: 0.007408oz; Contact Plating: Matte,Tin; Min Operating Temperature: -55°C; Max Operating Temperature: 125°C; Package Quantity: 3000; Packaging: Tape and Reel; Forward Current: 5A; Max Repetitive Reverse Voltage (Vrrm): 60V; Average Rectified Current: 5A; Peak Non-Repetitive Surge Current: 100A; Termination: SMD/SMT; Voltage Rating (DC): 60V; Current Rating: 5A; Output Current: 5A; Max Reverse Voltage (DC): 60V; Length: 7.11mm; Height: 2.5mm; Width: 6.22mm; Radiation Hardening: No; REACH SVHC: No SVHC; Lead Free: Lead Free; Supplier Part Number 1: B560C-FDICT-ND
D2 = 29# SMCJ36CA: TVS DIODE 36VWM 58.1VC SMC; Manufacturer: Littelfuse; Direction: Bidirectional; Reverse Breakdown Voltage: 40V; Operating Supply Voltage: 36V; Max Surge Current: 25.9A; Number of Bidirectional Channels: 1; Clamping Voltage: 58.1V; Peak Pulse Power: 1.5kW; Power Line Protection: No; Test Current: 1mA; Max Breakdown Voltage: 44.2V; Max Power Dissipation: 6.5W; Leakage Current: 1uA; Supplier 1: Digi-Key; Manufacturer Part Number: SMCJ36CA; Stock 1: 75326; Pricing 1: 1=0.7, 10=0.587, 25=0.514, 100=0.4406, 250=0.3818, 500=0.3231, 1000=0.2497 (USD); Mount: Surface Mount; Number of Pins: 2; Min Operating Temperature: -55°C; Max Operating Temperature: 150°C; Package Quantity: 3000; Packaging: Tape and Reel; Reverse Standoff Voltage: 36V; Min Breakdown Voltage: 40V; Breakdown Voltage: 40V; Number of Channels: 1; Polarity: Bidirectional; Termination: SMD/SMT; Number of Elements: 1; Peak Pulse Current: 25.9A; Power Dissipation: 1.5kW; Voltage Rating (DC): 36V; Composition: Zener; Length: 8.13mm; Height: 2.62mm; Width: 6.22mm; Radiation Hardening: No; REACH SVHC: No SVHC; Lead Free: Lead Free
D3 = 2#B560C-13-F: DIODE SCHOTTKY 60V 5A SMC; Digikey: B560C-FDICT-ND
D4 = 30# SK56L-TP: DIODE SCHOTTKY 60V 5A DO214AB; ComponentLink1URL: http://www.mccsemi.com/up_pdf/SK52L-SK510L(DO-214AB).PDF; ComponentLink1Description: http://www.mccsemi.com/up_pdf/SK52L-SK510L(DO-214AB).PDF; Digikey: SK56L-TPMSCT-ND
F1 = 13#MF-SMDF050-2: PTC RESET FUSE 60V 550MA 2018; Digikey: MF-SMDF050-2CT-ND
J1-J4 = PAD 1mm: TPoint
JP1 = Con2: as JP4 on sheet 03-INPUT; Digikey: ED2609-ND
L1 = 4#CLF10040T_150M: FIXED IND 15uH 3.2A 40 MOHM (10.0×9.7×3.8); Supplier 1: Newark
L2 = 11#LQH32PN2R2NN0L: Inductor Power Chip Shielded Wirewound 2.2uH 30% 1MHz Ferrite 1.6A 91.2mOhm DCR 1210 Embossed T/R; Manufacturer: Murata; Self Resonant Frequency: 70MHz; Saturation Current: 1.55A; DC Resistance (DCR): 76mR; Supplier 1: Digi-Key; Manufacturer Part Number: LQH32PN2R2NN0L; Stock 1: 21482; Pricing 1: 1=0.41, 10=0.361, 100=0.2483, 500=0.2122, 1000=0.1625 (USD); Mount: Surface Mount; Case/Package: 1210; Weight: 0.001552oz; Core Material: Ferrite; Case Code (Metric): 3225; Case Code (Imperial): 1210; Min Operating Temperature: -40°C; Max Operating Temperature: 85°C; Tolerance: 30%; Packaging: Tape and Reel; Shielding: Shielded; Package Quantity: 1; Current Rating: 1.6A; Inductance: 2.2uh; Max DC Current: 1.55A; Termination: SMD/SMT; Composition: Wirewound; Test Frequency: 1MHz; DC Current: 1.6A; Military Standard: Not; Inductance Tolerance: 30%; Length: 3.2mm; Height: 2mm; Width: 2.5mm; Height - Seated (Max): 0.067inch; Depth: 2.8mm; Radiation Hardening: No; REACH SVHC: No SVHC; Lead Free: Lead Free; Supplier Part Number 1: 490-5336-1-ND
L3 = Inductor: 8.2µH Shielded Wirewound Inductor 4A 68 mOhm Max Nonstandard; Digikey: ASPI-7318-8R2M-TCT-ND
R1 R3 = 15K/R0603/1%: RES SMD 15K OHM 1% 1/10W 0603; Manufacturer: Yageo; Manufacturer Part Number: RC0603FR-0715KL; Power (Watts): 0.1W, 1/10W; Temperature Coefficient: ±100ppm/°C; RoHS: RoHS Compliant; Category: Resistors; Packaging: Digi-Reel®; Resistance (Ohms): 15k; Tolerance: ±1%; Composition: Thick Film; Features: Moisture Resistant; Operating Temperature: -55°C ~ 155°C; Package / Case: 0603 (1608 Metric); Supplier Device Package: 0603; Size / Dimension: 0.063" L x 0.031" W (1.60mm x 0.80mm); Height: 0.022" (0.55mm); Number of Terminations: 2; ComponentLink1URL: http://www.yageo.com/NewPortal/yageodocoutput?fileName=/pdf/R-Chip/PYu-RC_Group_51_RoHS_L_3.pdf; ComponentLink1Description: http://www.yageo.com/NewPortal/yageodocoutput?fileName=/pdf/R-Chip/PYu-RC_Group_51_RoHS_L_3.pdf; Supplier 1: Digi-Key; Supplier Part Number 1: 311-15.0KHRCT-ND
R2 = 249K/R0805/1%: as R19 on sheet 03-INPUT; Supplier 1: Digi-Key; RoHS: RoHS Compliant; Category: Resistors; Stock 1: 370515; Pricing 1: 1=0.1, 10=0.015, 100=0.006, 1000=0.00268, 2500=0.00233 (USD); Packaging: Cut Tape (CT); Part Status: Active; Tolerance: ±1%; Composition: Thick Film; Features: Moisture Resistant; Operating Temperature: -55°C ~ 155°C; Package / Case: 0603 (1608 Metric); Supplier Device Package: 0603; Size / Dimension: 0.063" L x 0.032" W (1.60mm x 0.80mm); Height - Seated (Max): 0.022" (0.55mm); Failure Rate: -; ComponentLink1URL: http://www.yageo.com/documents/recent/PYu-RC_Group_51_RoHS_L_8.pdf; ComponentLink1Description: http://www.yageo.com/documents/recent/PYu-RC_Group_51_RoHS_L_8.pdf
R4 = 3.3K/R0603/1%: RES SMD 3.3K OHM 1% 1/10W 0603; Manufacturer: Yageo; Manufacturer Part Number: RC0603FR-073K3L; Power (Watts): 0.1W, 1/10W; Temperature Coefficient: ±100ppm/°C; RoHS: RoHS Compliant; Category: Resistors; Packaging: Digi-Reel®; Resistance (Ohms): 3.3k; Tolerance: ±1%; Composition: Thick Film; Features: Moisture Resistant; Operating Temperature: -55°C ~ 155°C; Package / Case: 0603 (1608 Metric); Supplier Device Package: 0603; Size / Dimension: 0.063" L x 0.031" W (1.60mm x 0.80mm); Height: 0.022" (0.55mm); Number of Terminations: 2; ComponentLink1URL: http://www.yageo.com/NewPortal/yageodocoutput?fileName=/pdf/R-Chip/PYu-RC_Group_51_RoHS_L_3.pdf; ComponentLink1Description: http://www.yageo.com/NewPortal/yageodocoutput?fileName=/pdf/R-Chip/PYu-RC_Group_51_RoHS_L_3.pdf; Supplier 1: Digi-Key; Supplier Part Number 1: 311-3.30KHRCT-ND
R5 = 34.8K/R0805/1%: Thick Film Resistors - SMD 34.8K OHM 1% 0805; Manufacturer: Yageo; Manufacturer Part Number: RC0603FR-0734K8L; Power Rating: 100mW; Resistance: 34.8kR; Voltage Rating: 50V; Temperature Coefficient: 100ppm/°C; Supplier 1: Digi-Key; Stock 1: 82861; Pricing 1: 1=0.1, 10=0.026, 100=0.0107, 1000=0.0048, 2500=0.0042 (USD); Case/Package: 0603; Case Code (Imperial): 0603; Case Code (Metric): 1608; Min Operating Temperature: -55°C; Max Operating Temperature: 155°C; Tolerance: 1%; Packaging: Tape and Reel; Termination: SMD/SMT; Composition: Thick Film; Military Standard: Not; Voltage Rating (DC): 50V; Length: 1.6mm; Height: 0.45mm; Width: 0.8mm; Depth: 0.8mm; Lead Free: Lead Free; Supplier Part Number 1: 311-34.8KHRCT-ND
R6 = 200K/R0603/1%: RES SMD 200K OHM 1% 1/10W 0603; Manufacturer: Yageo; Manufacturer Part Number: RC0603FR-07200KL; Power (Watts): 0.1W, 1/10W; Temperature Coefficient: ±100ppm/°C; Supplier 1: Digi-Key; RoHS: RoHS Compliant; Category: Resistors; Stock 1: 924437; Pricing 1: 1=0.1, 10=0.015, 100=0.006, 1000=0.00268, 2500=0.00233 (USD); Packaging: Cut Tape (CT); Part Status: Active; Tolerance: ±1%; Composition: Thick Film; Features: Moisture Resistant; Operating Temperature: -55°C ~ 155°C; Package / Case: 0603 (1608 Metric); Supplier Device Package: 0603; Size / Dimension: 0.063" L x 0.031" W (1.60mm x 0.80mm); Height - Seated (Max): 0.022" (0.55mm); Failure Rate: -; ComponentLink1URL: http://www.yageo.com/documents/recent/PYu-RC_Group_51_RoHS_L_7.pdf; ComponentLink1Description: http://www.yageo.com/documents/recent/PYu-RC_Group_51_RoHS_L_7.pdf; Supplier Part Number 1: 311-200KHRCT-ND
R7 = 15K/R0603/1%: 53.6 kOhms ±1% 0.125W, 1/8W Chip Resistor 0805 (2012 Metric) Automotive AEC-Q200 Thick Film; ComponentLink1URL: http://www.yageo.com/NewPortal/yageodocoutput?fileName=/pdf/R-Chip/PYu-RC_Group_51_RoHS_L_3.pdf; ComponentLink1Description: http://www.yageo.com/NewPortal/yageodocoutput?fileName=/pdf/R-Chip/PYu-RC_Group_51_RoHS_L_3.pdf; Digikey: 541-53.6KCCT-ND
R8 = 249K/R0805/1%: 523 kOhms ±1% 0.125W, 1/8W Chip Resistor 0805 (2012 Metric) Automotive AEC-Q200 Thick Film; ComponentLink1URL: http://www.yageo.com/documents/recent/PYu-RC_Group_51_RoHS_L_8.pdf; ComponentLink1Description: http://www.yageo.com/documents/recent/PYu-RC_Group_51_RoHS_L_8.pdf; Digikey: 541-523KCCT-ND
R9 = 15K/R0603/1%: 13 kOhms ±1% 0.125W, 1/8W Chip Resistor 0805 (2012 Metric) Automotive AEC-Q200 Thick Film; ComponentLink1URL: http://www.yageo.com/NewPortal/yageodocoutput?fileName=/pdf/R-Chip/PYu-RC_Group_51_RoHS_L_3.pdf; ComponentLink1Description: http://www.yageo.com/NewPortal/yageodocoutput?fileName=/pdf/R-Chip/PYu-RC_Group_51_RoHS_L_3.pdf; Digikey: 541-13.0KCCT-ND
R10 = 3.3K/R0603/1%: 10.2 kOhms ±1% 0.125W, 1/8W Chip Resistor 0805 (2012 Metric) Automotive AEC-Q200 Thick Film; ComponentLink1URL: http://www.yageo.com/NewPortal/yageodocoutput?fileName=/pdf/R-Chip/PYu-RC_Group_51_RoHS_L_3.pdf; ComponentLink1Description: http://www.yageo.com/NewPortal/yageodocoutput?fileName=/pdf/R-Chip/PYu-RC_Group_51_RoHS_L_3.pdf; Digikey: 541-10.0KCCT-ND
R11 = 34.8K/R0805/1%: 84.5 kOhms ±1% 0.125W, 1/8W Chip Resistor 0805 (2012 Metric) Automotive AEC-Q200 Thick Film; Digikey: 541-84.5KCCT-ND
R12 = 200K/R0603/1%: 162 kOhms ±1% 0.125W, 1/8W Chip Resistor 0805 (2012 Metric) Automotive AEC-Q200 Thick Film; ComponentLink1URL: http://www.yageo.com/documents/recent/PYu-RC_Group_51_RoHS_L_7.pdf; ComponentLink1Description: http://www.yageo.com/documents/recent/PYu-RC_Group_51_RoHS_L_7.pdf; Digikey: 541-162KCCT-ND
U1 = 21#TPS54360DDAR: Voltage Regulators - Switching Regulators 60 Vin,3.5 A,SD DC-DC Converter; Manufacturer: Texas Instruments; Output Current: 3.5A; Min Input Voltage: 4.5V; Number of Outputs: 1; Max Input Voltage: 60V; Output Voltage: 58.8V; Switching Frequency: 2.5MHz; Synchronous Rectifier: Yes; Min Output Voltage: 800mV; Quiescent Current: 146uA; Output Type: Adjustable; Output Configuration: Positive; Supplier 1: Digi-Key; Manufacturer Part Number: TPS54360DDAR; Stock 1: 40955; Pricing 1: 1=4.32, 10=3.883, 100=3.1815, 500=2.7083, 1000=2.2841 (USD); Mount: Surface Mount; Number of Pins: 8; Contact Plating: Gold; Min Operating Temperature: -40°C; Max Operating Temperature: 125°C; Packaging: Tape and Reel; Package Quantity: 2500; Max Output Current: 3.5A; Max Output Voltage: 58.8V; Operating Supply Voltage: 60V; Radiation Hardening: No; REACH SVHC: No SVHC; Lead Free: Lead Free; Supplier Part Number 1: 296-37676-1-ND; Case/Package: DDA R-PDSO-G8
U2 = 21#TPS54360DDAR: Buck, Split Rail Switching Regulator IC Positive Adjustable 0.8V 1 Output 3.5A 8-PowerSOIC (0.154", 3.90mm Width); Digikey: 296-37676-1-ND
U3 U4 = 20#TLV73333PDBVR: LDO Regulator Pos 3.3V 0.3A 5-Pin SOT-23 T/R; Manufacturer: Texas Instruments; Number of Outputs: 1; Min Input Voltage: 1.4V; Max Input Voltage: 5.5V; Max Output Current: 300mA; Dropout Voltage: 125mV; Min Current Limit: 360mA; Polarity: Positive; Quiescent Current: 60uA; Accuracy: 1%; Output Type: Fixed; Manufacturer Part Number: TLV73333PDBVR; Mount: Surface Mount; Case/Package: SOT-23-5; Number of Pins: 5; Weight: 0.000557oz; Contact Plating: Gold; Min Operating Temperature: -40°C; Max Operating Temperature: 125°C; Packaging: Tape and Reel; Output Voltage: 3.3V; Output Current: 300mA; Number of Regulators: 1; Package Quantity: 3000; Radiation Hardening: No; Lead Free: Lead Free; Supplier 1: Newark

## Sheet 04-OUTPUT.SchDoc: *OUTPUT
size A; SheetNumber: 5; SheetTotal: 7
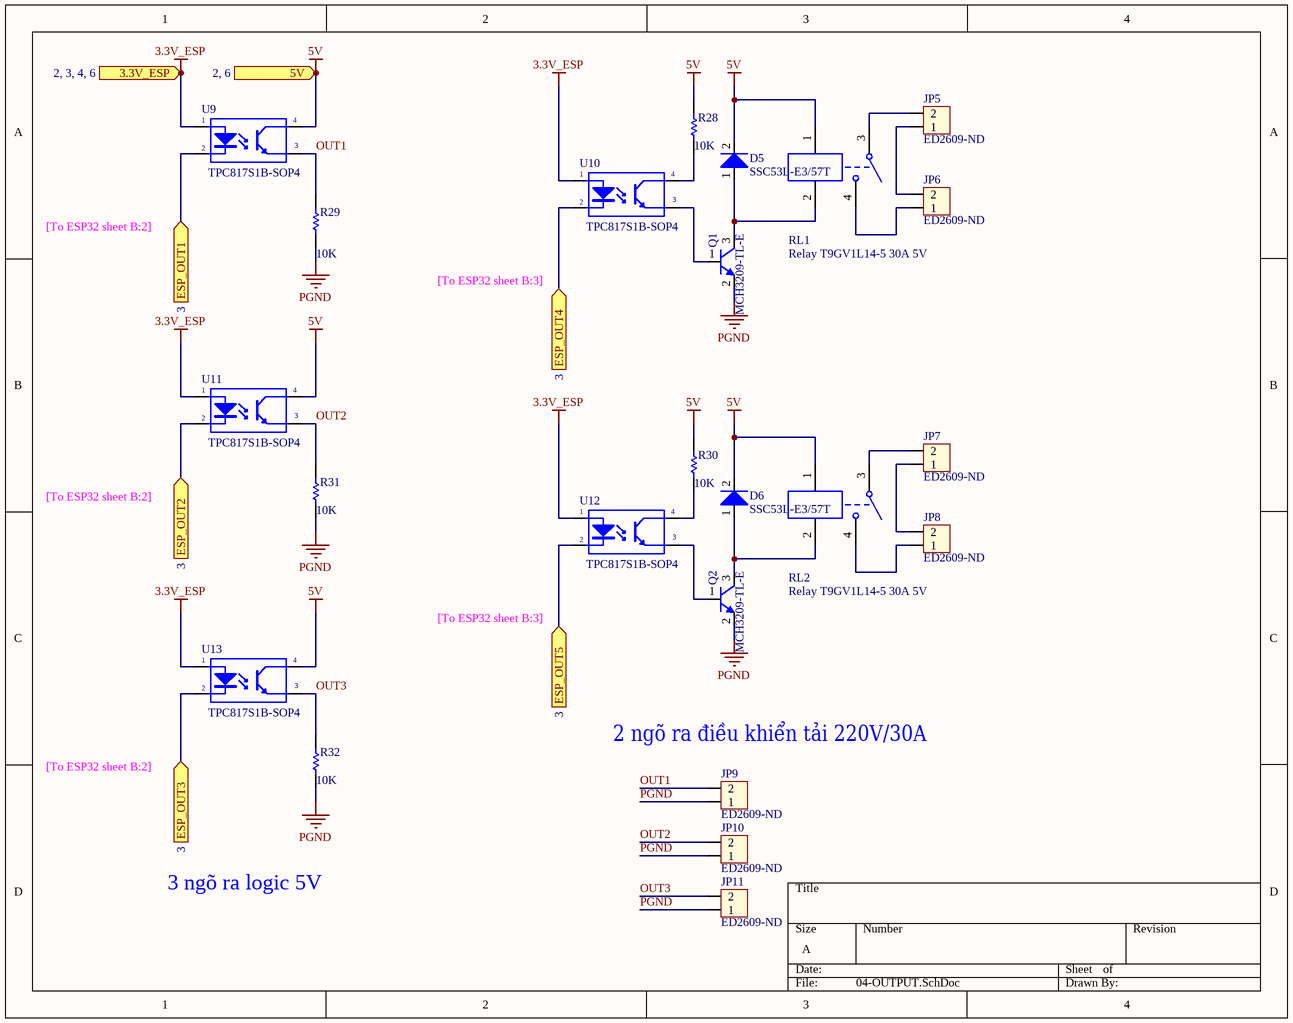
[diagram p4: 04-OUTPUT.SchDoc]

### Parts
D5  SSC53L-E3/57T  [SSC53L-E3/57T]
D6  SSC53L-E3/57T  [SSC53L-E3/57T]
JP5  ED2609-ND  [DOMINO_OSTTC_2P]
JP6  ED2609-ND  [DOMINO_OSTTC_2P]
JP7  ED2609-ND  [DOMINO_OSTTC_2P]
JP8  ED2609-ND  [DOMINO_OSTTC_2P]
JP9  ED2609-ND  [DOMINO_OSTTC_2P]
JP10  ED2609-ND  [DOMINO_OSTTC_2P]
JP11  ED2609-ND  [DOMINO_OSTTC_2P]
Q1  MCH3209-TL-E  [MCH3209-TL-E  SOT-323]
Q2  MCH3209-TL-E  [MCH3209-TL-E  SOT-323]
R28  10K  [Res 0805 SMD]
R29  10K  [Res 0805 SMD]
R30  10K  [Res 0805 SMD]
R31  10K  [Res 0805 SMD]
R32  10K  [Res 0805 SMD]
RL1  Relay T9GV1L14-5 30A 5V  [Relay T9GV1L14-5 30A 5V]
RL2  Relay T9GV1L14-5 30A 5V  [Relay T9GV1L14-5 30A 5V]
U9  TPC817S1B-SOP4  [TPC817-4SOP]
U10  TPC817S1B-SOP4  [TPC817-4SOP]
U11  TPC817S1B-SOP4  [TPC817-4SOP]
U12  TPC817S1B-SOP4  [TPC817-4SOP]
U13  TPC817S1B-SOP4  [TPC817-4SOP]

### Ports
3.3V_ESP (in, see 2, 3, 4, 6), 5V (in, see 2, 6), ESP_OUT1 (in, see 3), ESP_OUT2 (in, see 3), ESP_OUT3 (in, see 3), ESP_OUT4 (in, see 3), ESP_OUT5 (in, see 3)

### Nets
3.3V_ESP: U9.1(A) U10.1(A) U11.1(A) U12.1(A) U13.1(A) ; port 3.3V_ESP
5V: D5.2(K) D6.2(K) R28.2 R30.2 RL1.1 RL2.1 U9.4(C) U11.4(C) U13.4(C) ; port 5V
PGND: JP9.1 JP10.1 JP11.1 Q1.2(E) Q2.2(E) R29.1 R31.1 R32.1
OUT1: JP9.2 R29.2 U9.3(E)
OUT2: JP10.2 R31.2 U11.3(E)
OUT3: JP11.2 R32.2 U13.3(E)
NetD5_1: D5.1(A) Q1.3(C) RL1.2
NetD6_1: D6.1(A) Q2.3(C) RL2.2
NetJP5_1: JP5.1 JP6.2
NetJP5_2: JP5.2 RL1.3
NetJP6_1: JP6.1 RL1.4
NetJP7_1: JP7.1 JP8.2
NetJP7_2: JP7.2 RL2.3
NetJP8_1: JP8.1 RL2.4
NetQ1_1: Q1.1(B) U10.3(E)
NetQ2_1: Q2.1(B) U12.3(E)
NetR28_1: R28.1 U10.4(C)
NetR30_1: R30.1 U12.4(C)
NetU5_13: U9.2(K) ; port ESP_OUT1
NetU5_14: U11.2(K) ; port ESP_OUT2
NetU5_16: U13.2(K) ; port ESP_OUT3
NetU5_23: U12.2(K) ; port ESP_OUT5
NetU5_24: U10.2(K) ; port ESP_OUT4

### Notes on the sheet
- [To ESP32 sheet B:2]
- [To ESP32 sheet B:3]
- (near JP9) 2 ngõ ra điều khiển tải 220V/30A
- 3 ngõ ra logic 5V

### Library data of the parts
D5 D6 = 10A10: DIODE SCHOTTKY 30V 5A DO214AB; ComponentLink1Description: Datasheet; ComponentLink1URL: D:\Dropbox\Datasheets\Diodes and Rectifiers\Diodes\10AXX.pdf; Digikey: SSC53L-E3/57TGICT-ND
JP5-JP11 = Con2: as JP4 on sheet 03-INPUT; Digikey: ED2609-ND
Q1 Q2 = 2SC1815: Bipolar (BJT) Transistor NPN 30V 3A 450MHz 800mW Surface Mount 3-MCPH; ComponentLink1Description: Datasheet; ComponentLink1URL: D:\Dropbox\Datasheets\Transistors\P Channel Bipolar\2SC1815.pdf; Digikey: MCH3209-TL-EOSCT-ND
R28-R32 = 249K/R0805/1%: as R19 on sheet 03-INPUT; Supplier 1: Digi-Key; RoHS: RoHS Compliant; Category: Resistors; Stock 1: 370515; Pricing 1: 1=0.1, 10=0.015, 100=0.006, 1000=0.00268, 2500=0.00233 (USD); Packaging: Cut Tape (CT); Part Status: Active; Tolerance: ±1%; Composition: Thick Film; Features: Moisture Resistant; Operating Temperature: -55°C ~ 155°C; Package / Case: 0603 (1608 Metric); Supplier Device Package: 0603; Size / Dimension: 0.063" L x 0.032" W (1.60mm x 0.80mm); Height - Seated (Max): 0.022" (0.55mm); Failure Rate: -; ComponentLink1URL: http://www.yageo.com/documents/recent/PYu-RC_Group_51_RoHS_L_8.pdf; ComponentLink1Description: http://www.yageo.com/documents/recent/PYu-RC_Group_51_RoHS_L_8.pdf
RL1 RL2 = Relay T9GV1L14-5 30A 5V: General Purpose Relay SPST-NO (1 Form A) 5VDC Coil Through Hole; Digikey: T9GV1L14-5
U9-U13 = PC817: as U6 on sheet 03-INPUT; Digikey: TPC817S1BRAGCT-ND

## Sheet 06-SIM800C.SchDoc: *MODUL SIM800
size A3; SheetNumber: 7; SheetTotal: 7
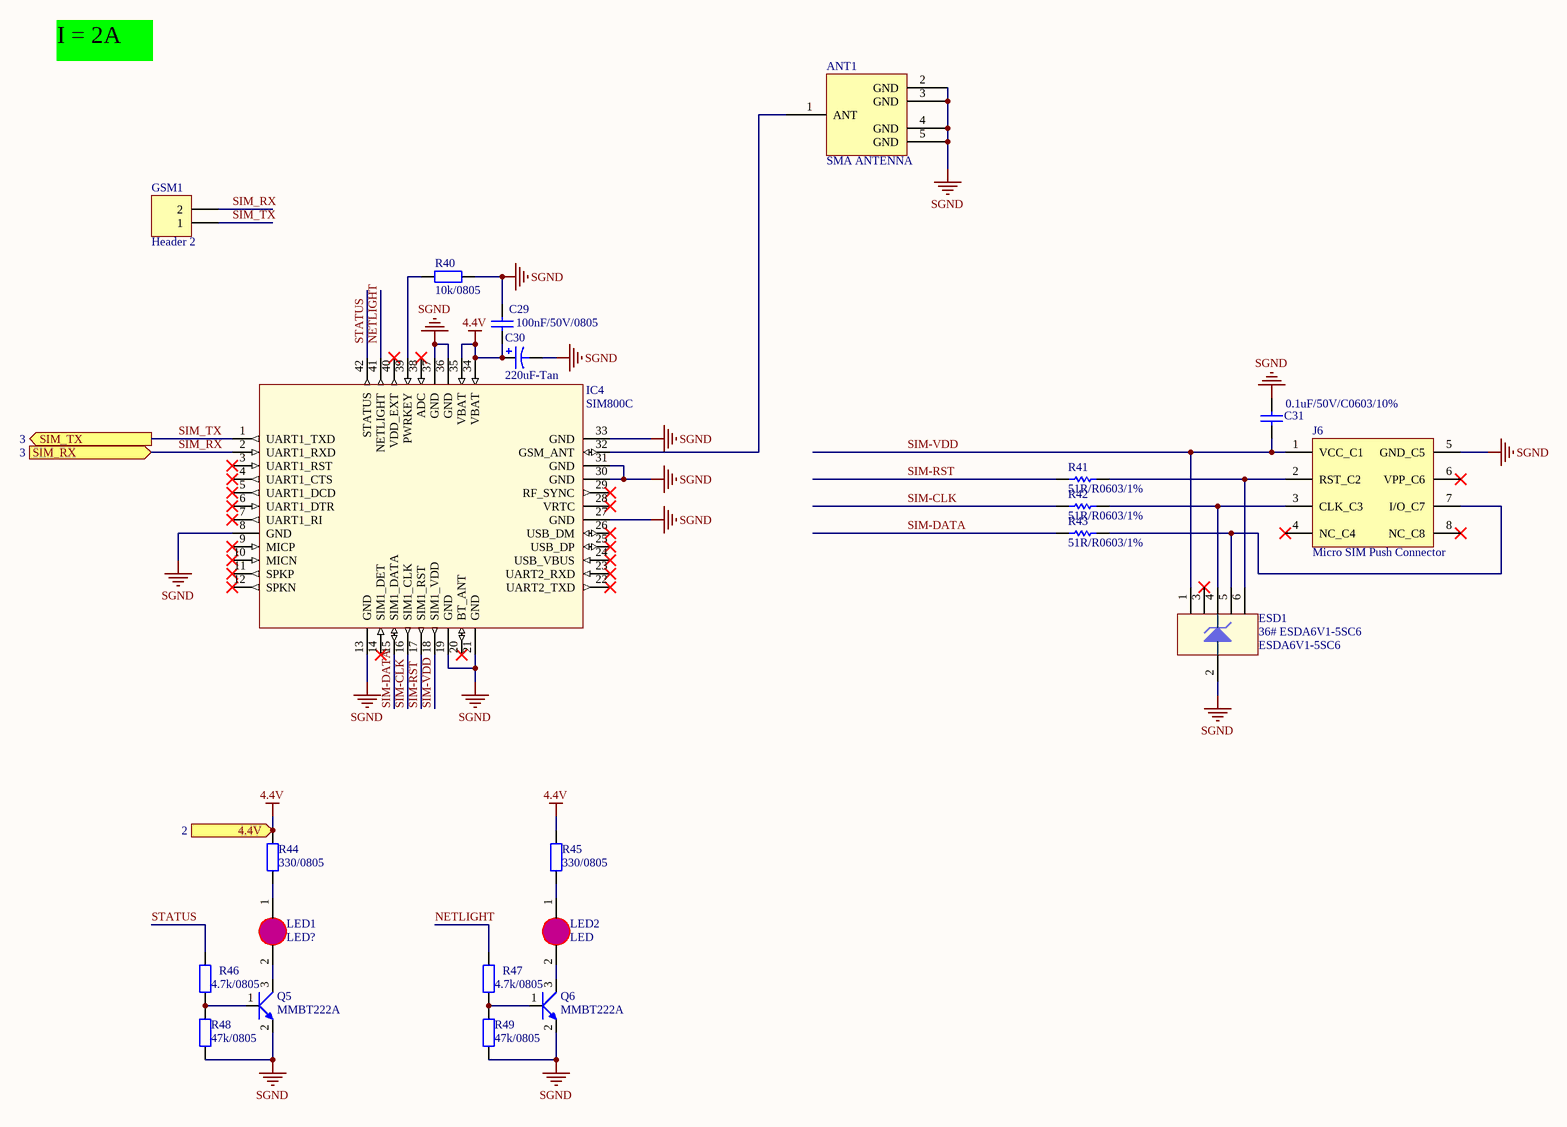
[diagram p5: 06-SIM800C.SchDoc]

### Parts
ANT1  SMA ANTENNA  [atenna_ra]
C29  100nF/50V/0805  [Cap Ceramic 0805 SMD]
C30  220uF-Tan  [CAP TANT CASE E SMD]
C31  0.1uF/50V/C0603/10%  [Cap Ceramic 0603 SMD]
ESD1  36# ESDA6V1-5SC6  Supplier Part Number 1: ESDA6V1-5SC6  [36# ESDA6V1-5SC6]
GSM1  Header 2  [Header_2]
IC4  SIM800C  [SIM800C]
J6  Micro SIM Push Connector  [9# SIM holder]
LED1  LED?  [Led 0805R]
LED2  LED  [Led 0805R]
Q5  MMBT222A  [MMBT2222A]
Q6  MMBT222A  [MMBT2222A]
R40  10k/0805  [RESC2012(0805)]
R41  51R/R0603/1%  [Res 0603 SMD]
R42  51R/R0603/1%  [Res 0603 SMD]
R43  51R/R0603/1%  [Res 0603 SMD]
R44  value 330/0805  [RESC2012(0805)]  (hidden comment: R0805)
R45  value 330/0805  [RESC2012(0805)]  (hidden comment: R0805)
R46  value 4.7k/0805  [RESC2012(0805)]  (hidden comment: R0805)
R47  value 4.7k/0805  [RESC2012(0805)]  (hidden comment: R0805)
R48  value 47k/0805  [RESC2012(0805)]  (hidden comment: R0805)
R49  value 47k/0805  [RESC2012(0805)]  (hidden comment: R0805)

### Ports
4.4V (in, see 2), SIM_RX (in, see 3), SIM_TX (out, see 3)

### Nets
4.4V: C29.1 C30.1 IC4.34(VBAT) IC4.35(VBAT) R44.1 R45.1 ; port 4.4V
SGND: ANT1.2(GND) ANT1.3(GND) ANT1.4(GND) ANT1.5(GND) C29.2 C30.2 C31.2 ESD1.2(GND) IC4.8(GND) IC4.13(GND) IC4.19(GND) IC4.21(GND) IC4.27(GND) IC4.30(GND) IC4.31(GND) IC4.33(GND) IC4.36(GND) IC4.37(GND) J6.5(GND_C5) Q5.2 Q6.2 R40.2 R48.2 R49.2
NETLIGHT: IC4.41(NETLIGHT) R47.1
SIM-CLK: IC4.16(SIM1_CLK) R42.1
SIM-DATA: IC4.15(SIM1_DATA) R43.1
SIM-RST: IC4.17(SIM1_RST) R41.1
SIM-VDD: C31.1 ESD1.1(IO1) IC4.18(SIM1_VDD) J6.1(VCC_C1)
SIM_RX: GSM1.2 IC4.2(UART1_RXD) ; port SIM_RX
SIM_TX: GSM1.1 IC4.1(UART1_TXD) ; port SIM_TX
STATUS: IC4.42(STATUS) R46.1
NetANT1_1: ANT1.1(ANT) IC4.32(GSM_ANT)
NetESD1_4: ESD1.4(IO3) J6.3(CLK_C3) R42.2
NetESD1_5: ESD1.5(IO4) J6.7(I/O_C7) R43.2
NetESD1_6: ESD1.6(IO5) J6.2(RST_C2) R41.2
NetIC4_39: IC4.39(PWRKEY) R40.1
NetLED1_1: LED1.1(A) R44.2
NetLED1_2: LED1.2(K) Q5.3
NetLED2_1: LED2.1(A) R45.2
NetLED2_2: LED2.2(K) Q6.3
NetQ5_1: Q5.1 R46.2 R48.1
NetQ6_1: Q6.1 R47.2 R49.1

Not connected (* = marked no-connect by the designer): ESD1 3(IO2)*; IC4 3(UART1_RST)* 4(UART1_CTS)* 5(UART1_DCD)* 6(UART1_DTR)* 7(UART1_RI)* 9(MICP)* 10(MICN)* 11(SPKP)* 12(SPKN)* 14(SIM1_DET)* 20(BT_ANT)* 22(UART2_TXD)* 23(UART2_RXD)* 24(USB_VBUS)* 25(USB_DP)* 26(USB_DM)* 28(VRTC)* 29(RF_SYNC)* 38(ADC)* 40(VDD_EXT)*; J6 4(NC_C4)* 6(VPP_C6)* 8(NC_C8)*

### Notes on the sheet
- I = 2A
- Title
- Size:
- Date:
- A3
- Number:
- Time:
- Revision:
- Sheet
- of
- File:

### Library data of the parts
C29 = CapSMD: Value: 33p; Published: 8-Jun-2000; LatestRevisionDate: 17-Jul-2002; LatestRevisionNote: Re-released for DXP Platform.; PackageReference: RAD-0.3; Publisher: Altium Limited
C30 = CAP1210-Tan
C31 = 0.1uF/50V/C0603/10%: as C1 on sheet 01-POWER; RoHS: RoHS Compliant; Category: Capacitors; Packaging: Tape & Reel (TR); Tolerance: ±10%; Voltage - Rated: 50V; Temperature Coefficient: X7R; Mounting Type: Surface Mount, MLCC; Operating Temperature: -55°C ~ 125°C; Applications: General Purpose; Ratings: -; Package / Case: 0603 (1608 Metric); Size / Dimension: 0.063" L x 0.031" W (1.60mm x 0.80mm); Height - Seated (Max): -; Thickness (Max): 0.035" (0.90mm); Lead Spacing: -; Features: -; Lead Style: -; ComponentLink1URL: http://www.murata.com/~/media/webrenewal/support/library/catalog/products/capacitor/mlcc/c02e.ashx; ComponentLink1Description: http://www.murata.com/~/media/webrenewal/support/library/catalog/products/capacitor/mlcc/c02e.ashx; Supplier 1: Digi-Key; Supplier Part Number 1: 490-1519-1-ND
ESD1 = 36# ESDA6V1-5SC6: TRANSIL™ ARRAY FOR ESD PROTECTION; Supplier 1: Future Electronics
GSM1 = Header 2: Header, 2-Pin; LatestRevisionDate: 17-Jul-2002; LatestRevisionNote: Re-released for DXP Platform.; Publisher: Altium Limited
IC4 = SIM800C: SIM800C V1.00
J6 = 9#SIM Card Holder KF-016: https://www.alibaba.com/product-detail/Micro-SIM-Push-Connector-SIM-Card_60749325624.html?spm=a2700.7724838.2017115.23.25ee5ac4b0uZwo
LED1 LED2 = LED0805: LED SMD 0805
R40 R44-R49 = R0805: Resistor SMD 0805; Published: 8-Jun-2000; LatestRevisionDate: 17-Jul-2002; LatestRevisionNote: Re-released for DXP Platform.; PackageReference: AXIAL-0.4; Publisher: Altium Limited
R41-R43 = 22R/R0603/1%: RES SMD 22 OHM 1% 1/10W 0603; Manufacturer: Yageo; Manufacturer Part Number: RC0603FR-0722RL; Resistance (Ohms): 22; Power (Watts): 0.1W, 1/10W; Temperature Coefficient: ±100ppm/°C; RoHS: RoHS Compliant; Category: Resistors; Packaging: Cut Tape (CT); Tolerance: ±1%; Composition: Thick Film; Features: Moisture Resistant; Operating Temperature: -55°C ~ 155°C; Package / Case: 0603 (1608 Metric); Supplier Device Package: 0603; Size / Dimension: 0.063" L x 0.031" W (1.60mm x 0.80mm); Height: 0.022" (0.55mm); Number of Terminations: 2; ComponentLink1URL: http://www.yageo.com/NewPortal/yageodocoutput?fileName=/pdf/R-Chip/PYu-RC_Group_51_RoHS_L_3.pdf; ComponentLink1Description: http://www.yageo.com/NewPortal/yageodocoutput?fileName=/pdf/R-Chip/PYu-RC_Group_51_RoHS_L_3.pdf; Supplier 1: Digi-Key; Supplier Part Number 1: 311-22.0HRCT-ND